# EasyEDA Pro project source.epro

# Schematic Schematic1
Board Name: Board1; Create Date: 2025-07-05; Page Name: P1; Project Name: Pathfinder; Schematic Name: Schematic1; Update Date: 2025-07-05; Company: EasyEDA.com; Page Size: A4; Version: V1.0
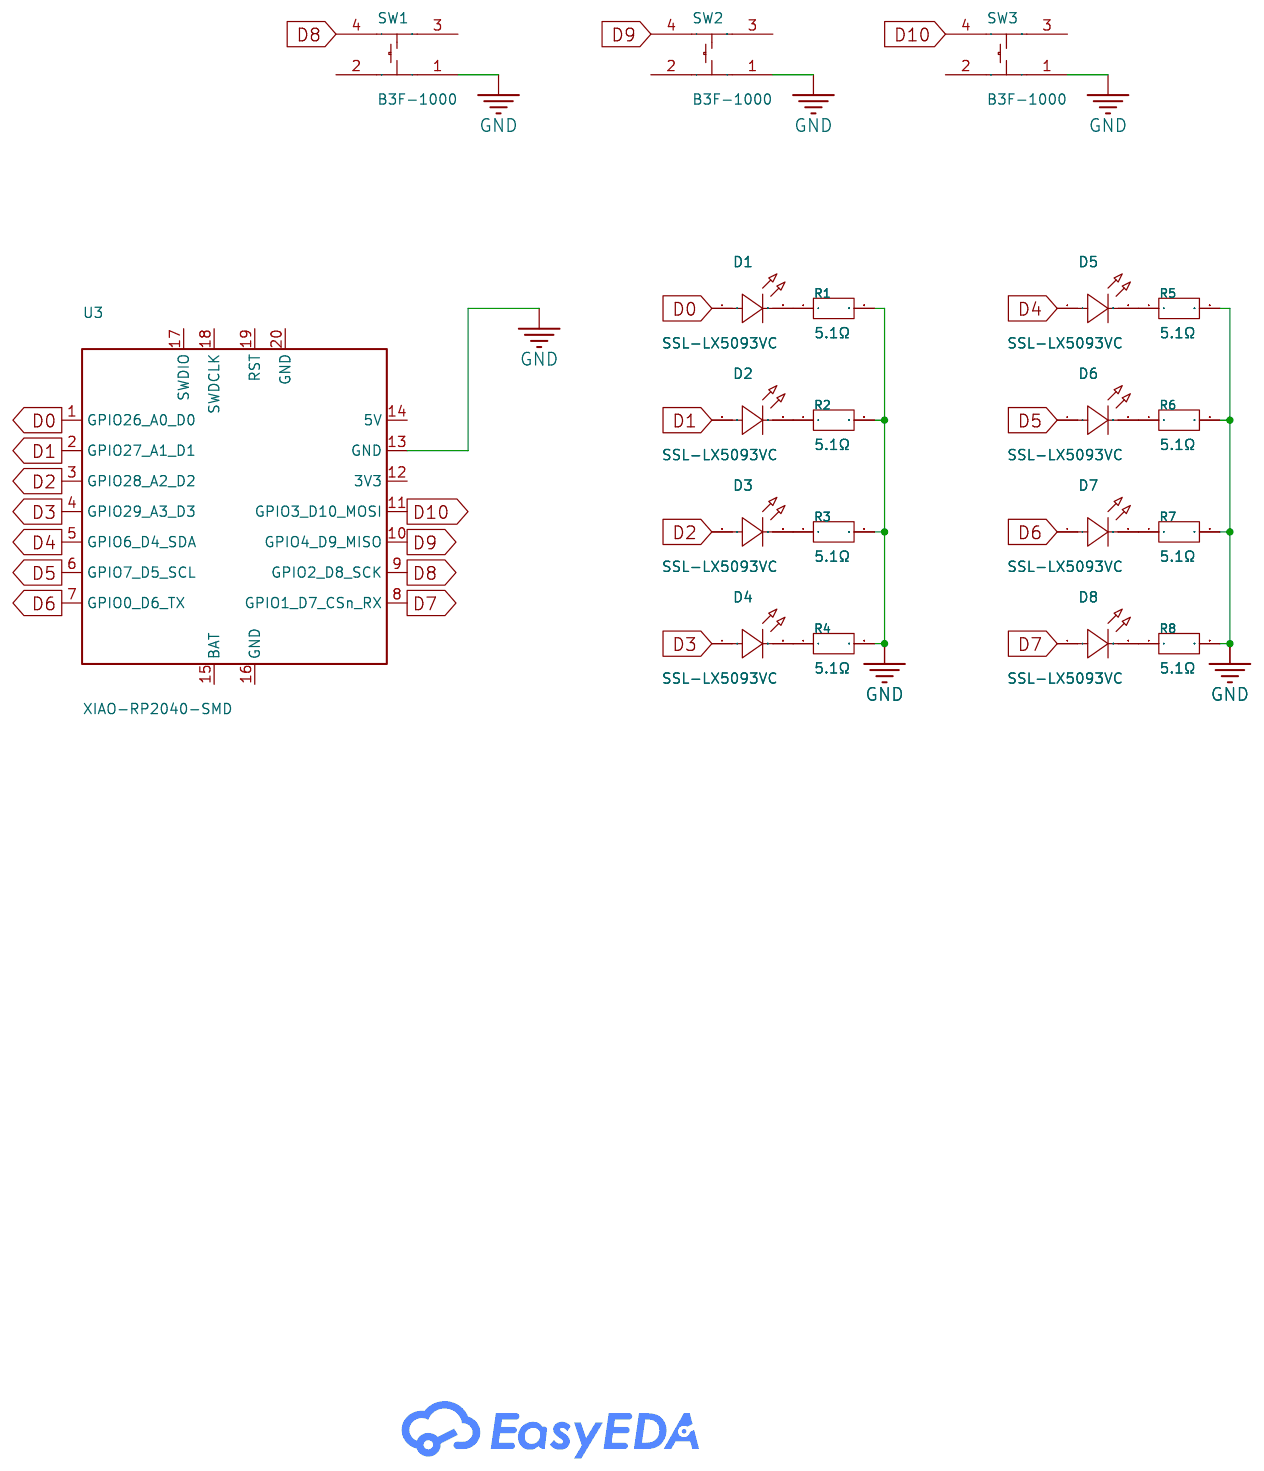
[diagram p0: schematic sheet]

## Parts
D1  SSL-LX5093VC  [LED-TH_BD5.0-P2.54-FD]
D2  SSL-LX5093VC  [LED-TH_BD5.0-P2.54-FD]
D3  SSL-LX5093VC  [LED-TH_BD5.0-P2.54-FD]
D4  SSL-LX5093VC  [LED-TH_BD5.0-P2.54-FD]
D5  SSL-LX5093VC  [LED-TH_BD5.0-P2.54-FD]
D6  SSL-LX5093VC  [LED-TH_BD5.0-P2.54-FD]
D7  SSL-LX5093VC  [LED-TH_BD5.0-P2.54-FD]
D8  SSL-LX5093VC  [LED-TH_BD5.0-P2.54-FD]
R1  5.1Ω  [RES-TH_BD2.4-L6.3-P10.30-D0.6]
R2  5.1Ω  [RES-TH_BD2.4-L6.3-P10.30-D0.6]
R3  5.1Ω  [RES-TH_BD2.4-L6.3-P10.30-D0.6]
R4  5.1Ω  [RES-TH_BD2.4-L6.3-P10.30-D0.6]
R5  5.1Ω  [RES-TH_BD2.4-L6.3-P10.30-D0.6]
R6  5.1Ω  [RES-TH_BD2.4-L6.3-P10.30-D0.6]
R7  5.1Ω  [RES-TH_BD2.4-L6.3-P10.30-D0.6]
R8  5.1Ω  [RES-TH_BD2.4-L6.3-P10.30-D0.6]
SW1  B3F-1000  [KEY-TH_4P-L6.2-W6.2-P4.50-LS6.5]
SW2  B3F-1000  [KEY-TH_4P-L6.2-W6.2-P4.50-LS6.5]
SW3  B3F-1000  [KEY-TH_4P-L6.2-W6.2-P4.50-LS6.5]
U3  XIAO-RP2040-SMD  [XIAO-RP2040-DIP]

## Library data of the parts
D1-D8 = WP7113SGC: Emitted Color:Emerald Forward Voltage (VF):2.2V Forward Voltage (VF):2.2V Forward Current:20mA Dominant Wavelength:568nm Dominant Wavelength:568nm Peak Wavelength:565nm Lens Color:Colorless Transparent Lens Luminous Intensity:240mcd Luminous Intensity:240; Supplier Part: C5831641; Manufacturer: Kingbright; Supplier Footprint: 插件,D=5mm; JLCPCB Part Class: Extended Part; Datasheet: https://atta.szlcsc.com/upload/public/pdf/source/231023/WP7113SGC.pdf-13509fd1c1ed9413b4ad296e97a1979f.pdf; Supplier: LCSC; Emitted Color: Emerald; Forward Voltage (VF): 2.2V; Forward Current: 20mA; Dominant Wavelength: 568nm; Peak Wavelength: 565nm; Lens Color: Colorless Transparent Lens; Luminous Intensity: 240mcd; Viewing Angle: 20°
R1-R8 = CFR-25JB-52-5R1: Type:Carbon Resister Resistance: Tolerance:±5% Tolerance:±5% Overload Voltage (Max):250V Power(Watts):250mW Temperature Coefficient:-500ppm/℃~+350ppm/℃ Temperature Coefficient:-500ppm/℃~+350ppm/℃ Operating Temperature Range:-55℃~+155℃ Operating Temperatur; LCSC Part Name: 碳膜电阻 5.1Ω ±5% 250mW; Supplier Part: C1364156; Manufacturer: YAGEO(国巨); Supplier Footprint: 插件,D2.4xL6.3mm; JLCPCB Part Class: Extended Part; Datasheet: https://atta.szlcsc.com/upload/public/pdf/source/20210608/DF59A3E7630CF04A482E596291E44FBF.pdf; Supplier: LCSC; Type: Carbon Resister; Tolerance: ±5%; Overload Voltage (Max): 250V; Power(Watts): 250mW; Temperature Coefficient: -500ppm/℃~+350ppm/℃; Operating Temperature Range: -55℃~+155℃
SW1-SW3 = B3F-1000: Circuit:SPST Actuator Style:Round Button Mounting Style:- Switch Length:6mm Switch Width:6mm Switch Height:4.3mm Contact Current:50mA Voltage Rating (DC):24V With Lamp:- Mechanical Life:-; Supplier Part: C93157; Manufacturer: OMRON(欧姆龙); Supplier Footprint: 插件-4P,6x6mm; JLCPCB Part Class: Extended Part; Supplier: LCSC; Circuit: SPST; Actuator Style: Round Button; Switch Length: 6mm; Switch Width: 6mm; Switch Height: 4.3mm; Contact Current: 50mA; Voltage Rating (DC): 24V
U3 = XIAO-RP2040-SMD

## Nets
GND: R1.2 R2.2 R3.2 R4.2 R5.2 R6.2 R7.2 R8.2 SW1.1 SW2.1 SW3.1 U3.13(GND)
D0: D1.1 U3.1(GPIO26_A0_D0)
D1: D2.1 U3.2(GPIO27_A1_D1)
D2: D3.1 U3.3(GPIO28_A2_D2)
D3: D4.1 U3.4(GPIO29_A3_D3)
D4: D5.1 U3.5(GPIO6_D4_SDA)
D5: D6.1 U3.6(GPIO7_D5_SCL)
D6: D7.1 U3.7(GPIO0_D6_TX)
D7: D8.1 U3.8(GPIO1_D7_CSn_RX)
D8: SW1.4 U3.9(GPIO2_D8_SCK)
D9: SW2.4 U3.10(GPIO4_D9_MISO)
D10: SW3.4 U3.11(GPIO3_D10_MOSI)
$1N1005: D1.2 R1.1
$1N1044: D2.2 R2.1
$1N1083: D3.2 R3.1
$1N1122: D4.2 R4.1
$1N2132: D8.2 R8.1
$1N2140: D7.2 R7.1
$1N2144: D5.2 R5.1
$1N2146: D6.2 R6.1

Not connected (* = marked no-connect by the designer): SW1 2 3; SW2 2 3; SW3 2 3; U3 12(3V3) 14(5V) 15(BAT) 16(GND) 17(SWDIO) 18(SWDCLK) 19(RST) 20(GND)

# Board PCB1
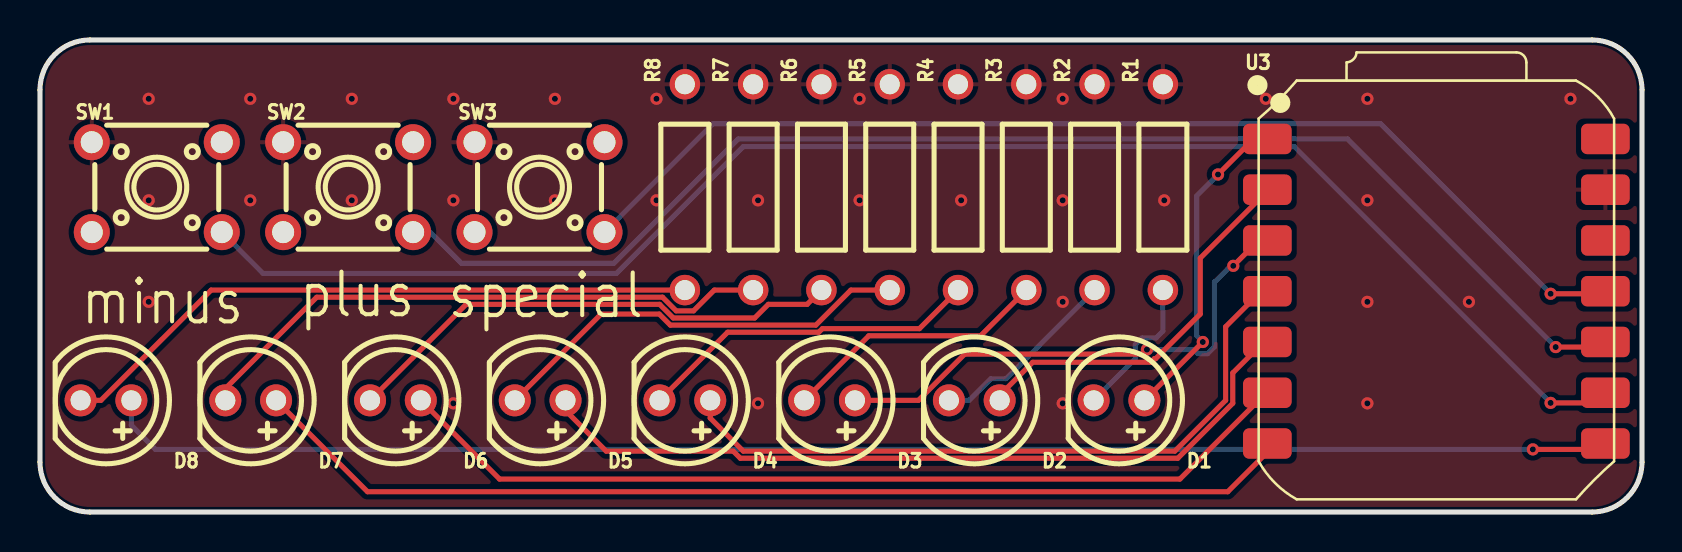
[diagram p1: board, top side]
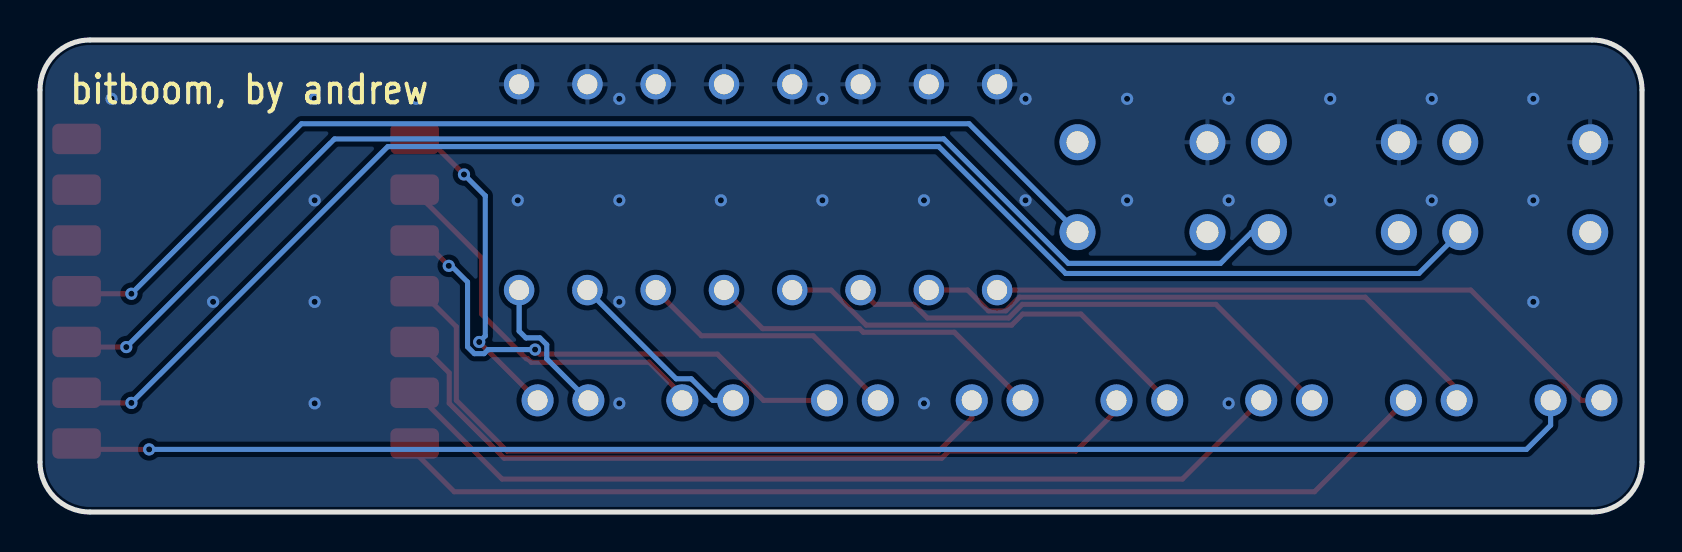
[diagram p2: board, bottom side, seen from below]

Outline 80.14 x 23.62 mm; copper layers: Top Layer, Bottom Layer. Coordinates in mm from the lower left corner of the outline.
Outline path: 0,21.12 0,2.5 arc(0.73,0.73) 2.5,0 77.64,0 arc(79.4,0.73) 80.14,2.5 80.14,21.12 arc(79.4,22.89) 77.64,23.62 2.5,23.62 arc(0.73,22.89) 0,21.12
Stack: Top Layer 0.035mm / Dielectric1 1.51mm FR4 er 4.5 / Bottom Layer 0.035mm

## Design rules (mm)
template: JLCPCB Capability(Two Layers Board)
spacing copperThickness1oz (default): track to track 0.102, other pairs 0.152 to 0.3
spacing copperThickness2oz: track to track 0.203, other pairs 0.152 to 0.3
track width copperThickness1oz (default): min 0.127, default 0.254, max 2.54
track width copperThickness2oz: min 0.203, default 0.254, max 2.54
differential pair differentialPair (default): width min 0.127, default 0.254, max 2.54; gap min 0.152, default 0.152
via viaSize (default): diameter min 0.5, default 0.61, max 10; hole min 0.3, default 0.305, max 6.3

## Placement (name value [footprint] x y rotation side)
D1  SSL-LX5093VC  [LED-TH_BD5.0-P2.54-FD]  53.97 5.59 180 top
D2  SSL-LX5093VC  [LED-TH_BD5.0-P2.54-FD]  46.74 5.59 180 top
D3  SSL-LX5093VC  [LED-TH_BD5.0-P2.54-FD]  39.5 5.59 180 top
D4  SSL-LX5093VC  [LED-TH_BD5.0-P2.54-FD]  32.26 5.59 180 top
D5  SSL-LX5093VC  [LED-TH_BD5.0-P2.54-FD]  25.02 5.59 180 top
D6  SSL-LX5093VC  [LED-TH_BD5.0-P2.54-FD]  17.78 5.59 180 top
D7  SSL-LX5093VC  [LED-TH_BD5.0-P2.54-FD]  10.54 5.59 180 top
D8  SSL-LX5093VC  [LED-TH_BD5.0-P2.54-FD]  3.3 5.59 180 top
R1  5.1Ω  [RES-TH_BD2.4-L6.3-P10.30-D0.6]  56.17 16.26 90 top
R2  5.1Ω  [RES-TH_BD2.4-L6.3-P10.30-D0.6]  52.75 16.26 90 top
R3  5.1Ω  [RES-TH_BD2.4-L6.3-P10.30-D0.6]  49.34 16.26 90 top
R4  5.1Ω  [RES-TH_BD2.4-L6.3-P10.30-D0.6]  45.92 16.26 90 top
R5  5.1Ω  [RES-TH_BD2.4-L6.3-P10.30-D0.6]  42.51 16.26 90 top
R6  5.1Ω  [RES-TH_BD2.4-L6.3-P10.30-D0.6]  39.09 16.26 90 top
R7  5.1Ω  [RES-TH_BD2.4-L6.3-P10.30-D0.6]  35.67 16.26 90 top
R8  5.1Ω  [RES-TH_BD2.4-L6.3-P10.30-D0.6]  32.26 16.26 90 top
SW1  B3F-1000  [KEY-TH_4P-L6.2-W6.2-P4.50-LS6.5]  5.84 16.26 0 top
SW2  B3F-1000  [KEY-TH_4P-L6.2-W6.2-P4.50-LS6.5]  15.41 16.26 0 top
SW3  B3F-1000  [KEY-TH_4P-L6.2-W6.2-P4.50-LS6.5]  24.99 16.26 0 top
U3  XIAO-RP2040-SMD  [XIAO-RP2040-DIP]  69.85 11.05 0 top

## Footprints (pads in the part's own frame, mm; a bottom-side part is the same pattern mirrored in y, then rotated)
KEY-TH_4P-L6.2-W6.2-P4.50-LS6.5
  round 1.8 hole 1.1: 1(-3.251,2.251) 2(3.251,2.251) 3(-3.251,-2.251) 4(3.251,-2.251)
LED-TH_BD5.0-P2.54-FD
  round 1.6 hole 1: 1(-1.27,0) 2(1.27,0)
RES-TH_BD2.4-L6.3-P10.30-D0.6
  round 1.524 hole 1: 1(-5.15,0) 2(5.15,0)
XIAO-RP2040-DIP
  rrect 2.432x1.524 smd: 1(-8.455,7.62) 2(-8.455,5.08) 3(-8.455,2.54) 4(-8.455,0) 5(-8.455,-2.54) 6(-8.455,-5.08) 7(-8.455,-7.62) 8(8.455,-7.62) 9(8.455,-5.08) 10(8.455,-2.54) 11(8.455,0) 12(8.455,2.54) 13(8.455,5.08) 14(8.455,7.62)

## Nets
As in the schematic.

Pads without a net: SW1 2 3; SW2 2 3; SW3 2 3; U3 12 14

## Via types
v1: diameter 0.61, hole 0.305, Top Layer to Bottom Layer, 39 vias

## Routing (per net, layer and track width the routed paths; a pad name or vN(x,y) marks a point on that pad's centre or on a via; arc(x,y) is an arc through that point)
GND:
  vias: v1(5.44,20.68) v1(5.44,15.6) v1(5.44,10.52) v1(10.52,20.68) v1(10.52,15.6) v1(15.6,20.68) v1(15.6,15.6) v1(20.68,20.68) v1(20.68,15.6) v1(20.68,5.44) v1(25.76,20.68) v1(25.76,15.6) v1(30.84,20.68) v1(30.84,15.6) v1(35.92,15.6) v1(35.92,5.44) v1(41,20.68) v1(41,15.6) v1(46.08,15.6) v1(51.16,20.68) v1(51.16,15.6) v1(51.16,10.52) v1(51.16,5.44) v1(56.24,15.6) v1(61.32,20.68) v1(66.4,20.68) v1(66.4,15.6) v1(66.4,10.52) v1(66.4,5.44) v1(71.48,10.52) v1(76.56,20.68)
D0: length 16.2
  Top Layer w0.254: 61.49,18.33 60.37,18.33 v1(58.93,16.89) ; D1.1 v1(58.17,8.51)
  Bottom Layer w0.254: v1(58.17,8.51) 57.86,8.81 57.86,15.82 v1(58.93,16.89)
D1: length 19.7
  Top Layer w0.254: 61.49,15.79 61.37,15.92 61.25,15.92 58.04,12.71 58.04,9.91 55.81,7.67 55.74,7.67 55.56,7.49 49.66,7.49 47.88,5.72 D2.1
D2: length 26
  Top Layer w0.254: v1(55.37,8.13) 55.14,7.9 46.25,7.9 43.94,5.59 D3.1 ; v1(59.69,12.32) 60.62,13.25 61.49,13.25
  Bottom Layer w0.254: v1(55.37,8.13) 57.72,8.13 57.92,7.93 58.41,7.93 58.75,8.27 58.75,11.51 59.56,12.32 v1(59.69,12.32)
D3: length 34.9
  Top Layer w0.254: 61.49,10.71 60.75,10.71 59.31,9.27 59.31,5.59 56.77,3.05 35.18,3.05 33.53,4.7 D4.1
D4: length 39.9
  Top Layer w0.254: D5.1 26.29,5.08 28.32,3.05 34.68,3.05 35.03,2.69 56.92,2.69 59.66,5.44 59.66,6.96 60.88,8.17 61.49,8.17
D5: length 45.7
  Top Layer w0.254: 61.49,5.63 61.01,5.63 57.02,1.65 22.99,1.65 19.05,5.59
D6: length 52.4
  Top Layer w0.254: 61.49,3.09 59.42,1.02 16.38,1.02 D7.1
D7: length 74.9
  Top Layer w0.254: 74.68,3.18 74.76,3.09 ; 74.76,3.13 77.66,3.13
  Bottom Layer w0.254: D8.1 4.57,4.34 5.78,3.13 v1(74.68,3.13)
D8: length 77.4
  Top Layer w0.254: v1(75.56,5.46) 77.49,5.46 77.66,5.63
  Bottom Layer w0.254: SW1.4 11.16,11.94 28.83,11.94 35.18,18.29 62.74,18.29 v1(75.56,5.46)
D9: length 66.6
  Top Layer w0.254: v1(75.82,8.26) 77.58,8.26 77.66,8.17
  Bottom Layer w0.254: SW2.4 19.52,14.01 21.08,12.45 28.7,12.45 34.92,18.67 65.41,18.67 v1(75.82,8.26)
D10: length 55.3
  Top Layer w0.254: v1(75.56,10.92) 77.45,10.92 77.66,10.71
  Bottom Layer w0.254: v1(75.56,10.92) 67.06,19.43 33.66,19.43 SW3.4
$1N1005: length 7.4
  Bottom Layer w0.254: D1.2 54.79,7.67 54.79,8.37 55.13,8.71 55.83,8.71 56.17,9.05 R1.1
$1N1044: length 9.6
  Bottom Layer w0.254: R2.1 48.31,6.67 47.56,6.67 46.48,5.59 D2.2
$1N1083: length 13.4
  Top Layer w0.254: D3.2 41.46,8.82 47.05,8.82 R3.1
$1N1122: length 17.2
  Top Layer w0.254: D4.2 34.4,9 38.96,9 39.14,9.18 43.99,9.18 R4.1
$1N2132: length 32.5
  Top Layer w0.254: R8.1 8.56,11.11 3.05,5.59 D8.2
$1N2140: length 29.6
  Top Layer w0.254: R7.1 33.73,11.11 32.69,10.07 31.83,10.07 31.14,10.75 13.84,10.75 9.27,6.18 D7.2
$1N2144: length 21.5
  Top Layer w0.254: D5.2 28.07,9.91 30.98,9.91 31.53,9.35 38.81,9.35 40.56,11.11 R5.1
$1N2146: length 25.4
  Top Layer w0.254: D6.2 21.32,10.39 30.99,10.39 31.68,9.71 35.75,9.71 36.43,10.39 38.38,10.39 R6.1

## Copper pours and planes (outline as drawn; the poured copper is in the pictures)
GND on Top Layer: -2.16,26.92 85.09,26.92 85.09,-2.03 -2.16,-2.03
GND on Bottom Layer: -1.14,25.27 82.68,25.27 82.68,-1.02 -1.14,-1.02

## Text on the board
Bottom Silkscreen Layer: bitboom, by andrew
Top Silkscreen Layer: minus | plus | special
